# EAGLE design nixie (EAGLE 9.2.2)
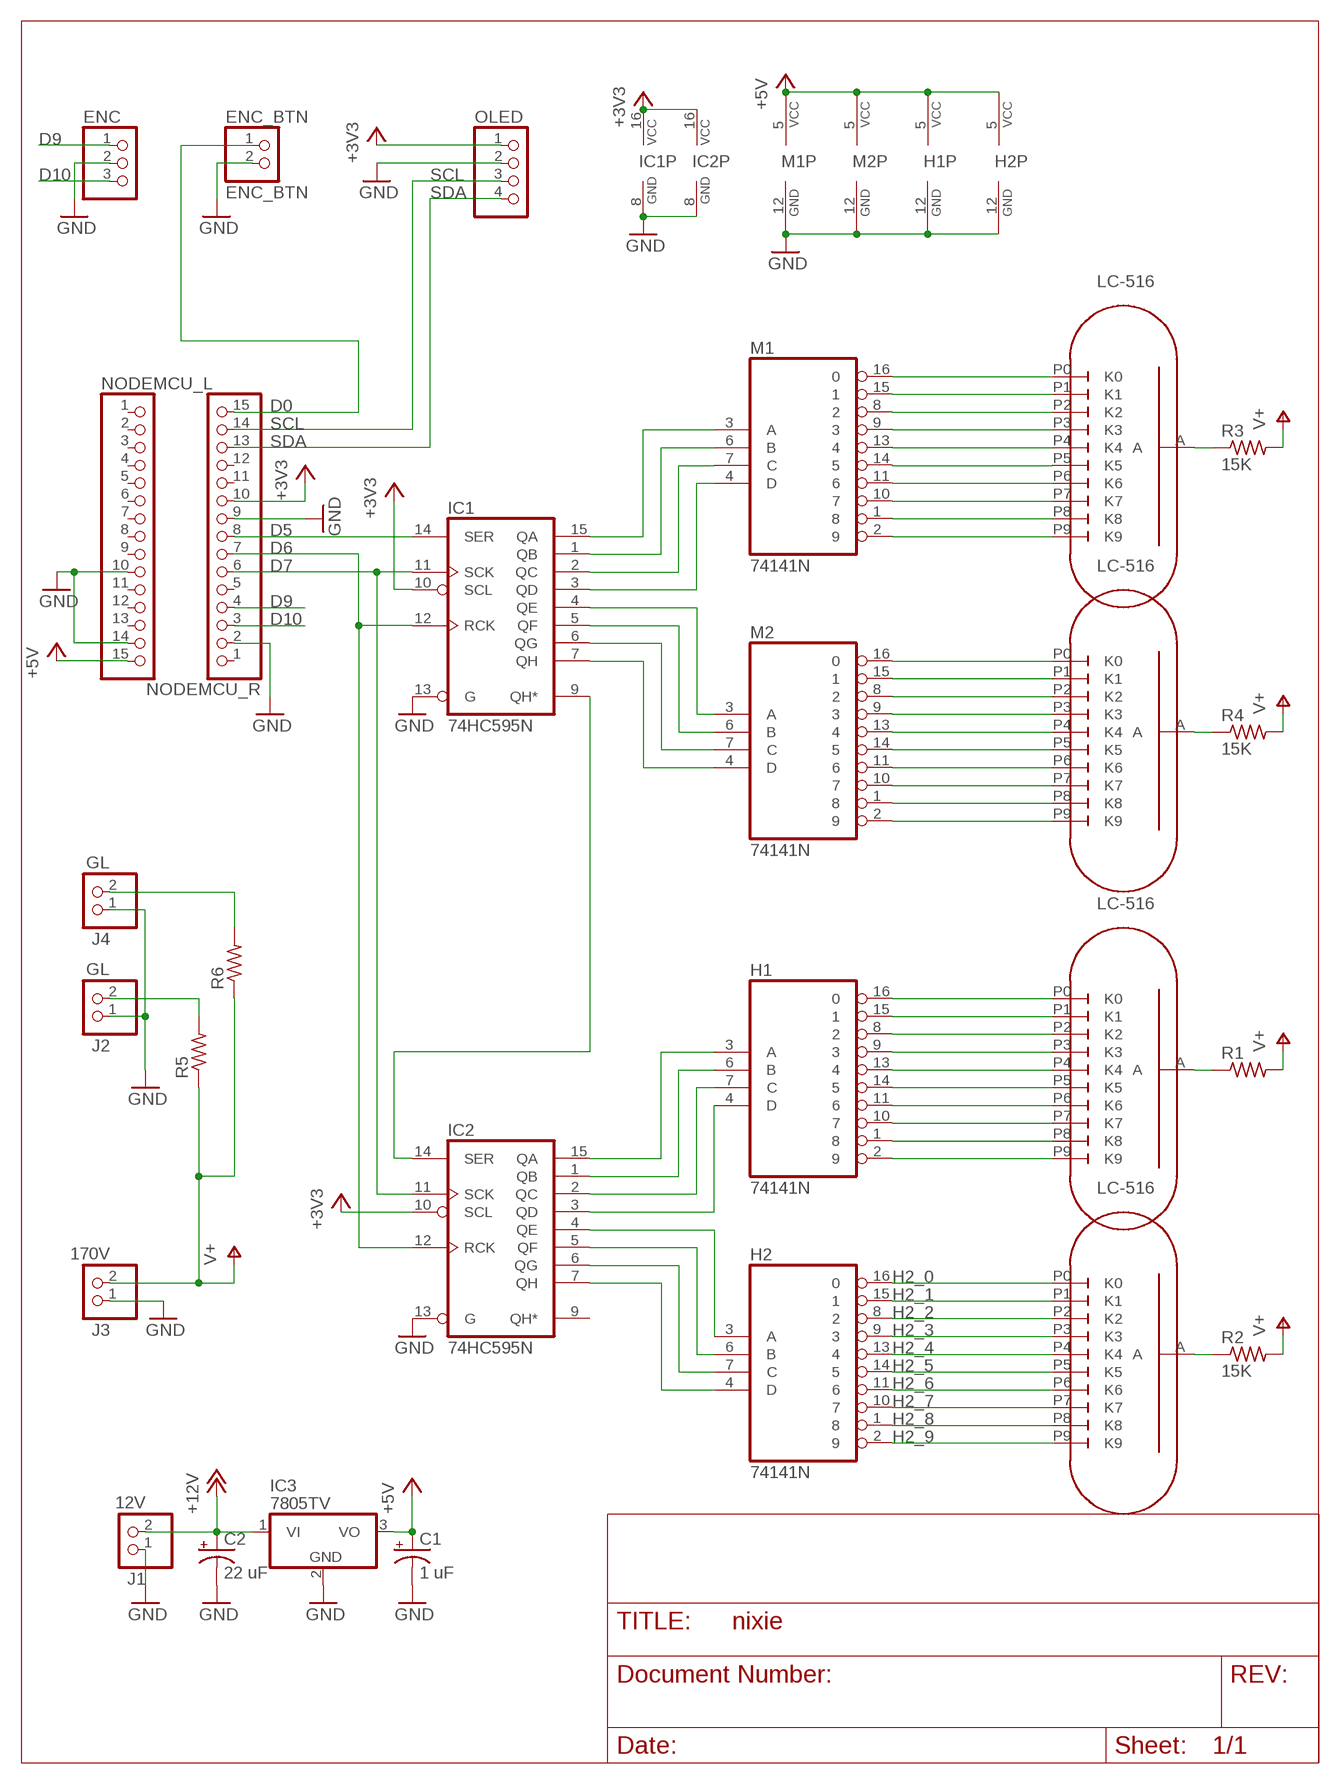
[diagram p0: schematic, sheet 1]

## Parts
C1  1 uF  CPOL-USTT2D5  [TT2D5]
C2  22 uF  CPOL-USTT2D5  [TT2D5]
ENC  PINHD-1X3  [1X03]
ENC_BTN  ENC_BTN  PINHD-1X2  [1X02]
H1  74141N  [DIL16]
H2  74141N  [DIL16]
IC1  74HC595N  [DIL16]
IC2  74HC595N  [DIL16]
IC3  7805TV  [TO220V]
J1  12V  PINHD-1X2  [1X02]
J2  GL  PINHD-1X2  [1X02]
J3  170V  PINHD-1X2  [1X02]
J4  GL  PINHD-1X2  [1X02]
M1  74141N  [DIL16]
M2  74141N  [DIL16]
NODEMCU_L  PINHD-1X15  [1X15]
NODEMCU_R  PINHD-1X15  [1X15]
OLED  PINHD-1X4  [1X04]
R1  15K  R-US_0207/10  [0207/10]
R2  15K  R-US_0207/10  [0207/10]
R3  15K  R-US_0207/10  [0207/10]
R4  15K  R-US_0207/10  [0207/10]
R5  100k  R-US_0207/10  [0207/10]
R6  100k  R-US_0207/10  [0207/10]
U$1M2  LC-516  [LC-516]
U$2M1  LC-516  [LC-516]
U$3H2  LC-516  [LC-516]
U$4H1  LC-516  [LC-516]

## Nets
+3V3: IC1.10(SCL) IC1.16(VCC) IC2.10(SCL) IC2.16(VCC) NODEMCU_R.10 OLED.1
+5V: C1.+ H1.5(VCC) H2.5(VCC) IC3.3(VO) M1.5(VCC) M2.5(VCC) NODEMCU_L.15
+12V: C2.+ IC3.1(VI) J1.2
D0: ENC_BTN.1 NODEMCU_R.15
D5: IC1.14(SER) NODEMCU_R.8
D6: IC1.12(RCK) IC2.12(RCK) NODEMCU_R.7
D7: IC1.11(SCK) IC2.11(SCK) NODEMCU_R.6
D9: ENC.1 NODEMCU_R.4
D10: ENC.3 NODEMCU_R.3
GND: C1.- C2.- ENC.2 ENC_BTN.2 H1.12(GND) H2.12(GND) IC1.8(GND) IC1.13(G) IC2.8(GND) IC2.13(G) IC3.2(GND) J1.1 J2.1 J3.1 J4.1 M1.12(GND) M2.12(GND) NODEMCU_L.10 NODEMCU_L.14 NODEMCU_R.2 NODEMCU_R.9 OLED.2
H2_0: H2.16 U$4H1.P0(K0)
H2_1: H2.15 U$4H1.P1(K1)
H2_2: H2.8 U$4H1.P2(K2)
H2_3: H2.9 U$4H1.P3(K3)
H2_4: H2.13 U$4H1.P4(K4)
H2_5: H2.14 U$4H1.P5(K5)
H2_6: H2.11 U$4H1.P6(K6)
H2_7: H2.10 U$4H1.P7(K7)
H2_8: H2.1 U$4H1.P8(K8)
H2_9: H2.2 U$4H1.P9(K9)
N$1: H1.16 U$3H2.P0(K0)
N$2: H1.2 U$3H2.P9(K9)
N$3: H1.9 U$3H2.P3(K3)
N$4: H1.13 U$3H2.P4(K4)
N$5: H1.14 U$3H2.P5(K5)
N$6: H1.11 U$3H2.P6(K6)
N$7: H1.10 U$3H2.P7(K7)
N$8: H1.1 U$3H2.P8(K8)
N$9: H1.8 U$3H2.P2(K2)
N$10: H1.15 U$3H2.P1(K1)
N$11: R1.1 U$3H2.A
N$12: J4.2 R6.2
N$13: J2.2 R5.2
N$22: R2.1 U$4H1.A
N$23: M1.16 U$1M2.P0(K0)
N$24: M1.9 U$1M2.P3(K3)
N$25: M1.13 U$1M2.P4(K4)
N$26: M1.14 U$1M2.P5(K5)
N$27: M1.11 U$1M2.P6(K6)
N$28: M1.10 U$1M2.P7(K7)
N$29: M1.1 U$1M2.P8(K8)
N$30: M1.2 U$1M2.P9(K9)
N$31: M1.8 U$1M2.P2(K2)
N$32: M1.15 U$1M2.P1(K1)
N$33: R3.1 U$1M2.A
N$34: M2.16 U$2M1.P0(K0)
N$35: M2.9 U$2M1.P3(K3)
N$36: M2.13 U$2M1.P4(K4)
N$37: M2.14 U$2M1.P5(K5)
N$38: M2.11 U$2M1.P6(K6)
N$39: M2.10 U$2M1.P7(K7)
N$40: M2.1 U$2M1.P8(K8)
N$41: M2.2 U$2M1.P9(K9)
N$42: M2.8 U$2M1.P2(K2)
N$43: M2.15 U$2M1.P1(K1)
N$44: R4.1 U$2M1.A
N$45: IC1.15(QA) M1.3(A)
N$46: IC1.1(QB) M1.6(B)
N$47: IC1.2(QC) M1.7(C)
N$48: IC1.3(QD) M1.4(D)
N$49: IC1.4(QE) M2.3(A)
N$50: IC1.5(QF) M2.6(B)
N$51: IC1.6(QG) M2.7(C)
N$52: IC1.7(QH) M2.4(D)
N$53: H1.3(A) IC2.15(QA)
N$54: H1.6(B) IC2.1(QB)
N$55: H1.7(C) IC2.2(QC)
N$56: H1.4(D) IC2.3(QD)
N$57: H2.3(A) IC2.4(QE)
N$58: H2.6(B) IC2.5(QF)
N$59: H2.7(C) IC2.6(QG)
N$60: H2.4(D) IC2.7(QH)
N$61: IC1.9(QH*) IC2.14(SER)
SCL: NODEMCU_R.14 OLED.3
SDA: NODEMCU_R.13 OLED.4
V+: J3.2 R1.2 R2.2 R3.2 R4.2 R5.1 R6.1
Unconnected: IC2.9(QH*) NODEMCU_L.1 NODEMCU_L.2 NODEMCU_L.3 NODEMCU_L.4 NODEMCU_L.5 NODEMCU_L.6 NODEMCU_L.7 NODEMCU_L.8 NODEMCU_L.9 NODEMCU_L.11 NODEMCU_L.12 NODEMCU_L.13 NODEMCU_R.1 NODEMCU_R.5 NODEMCU_R.11 NODEMCU_R.12

## Library data of the parts
C1 C2 = rcl:CPOL-US: POLARIZED CAPACITOR, American symbol; SPICEPREFIX: C
ENC = pinhead:PINHD-1X3: PIN HEADER
ENC_BTN J1-J4 = pinhead:PINHD-1X2: PIN HEADER
H1 H2 M1 M2 = 74xx-us:74*141: BCD to decimal DECODER/DRIVER
IC1 IC2 = 74xx-eu:74*595: 8-bit SHIFT REGISTER, output latch
IC3 = linear:78*: Positive VOLTAGE REGULATOR Source: http://cache.national.com/ds/LM/LM78L05.pdf http://www.fairchildsemi.com/ds/LM/LM7805.pdf
NODEMCU_L NODEMCU_R = pinhead:PINHD-1X15: PIN HEADER
OLED = pinhead:PINHD-1X4: PIN HEADER
R1-R6 = resistor:R-US_: RESISTOR, American symbol
U$1M2 U$2M1 U$3H2 U$4H1 = LC-516:LC-516: Nixie Tube LC-516

## Board
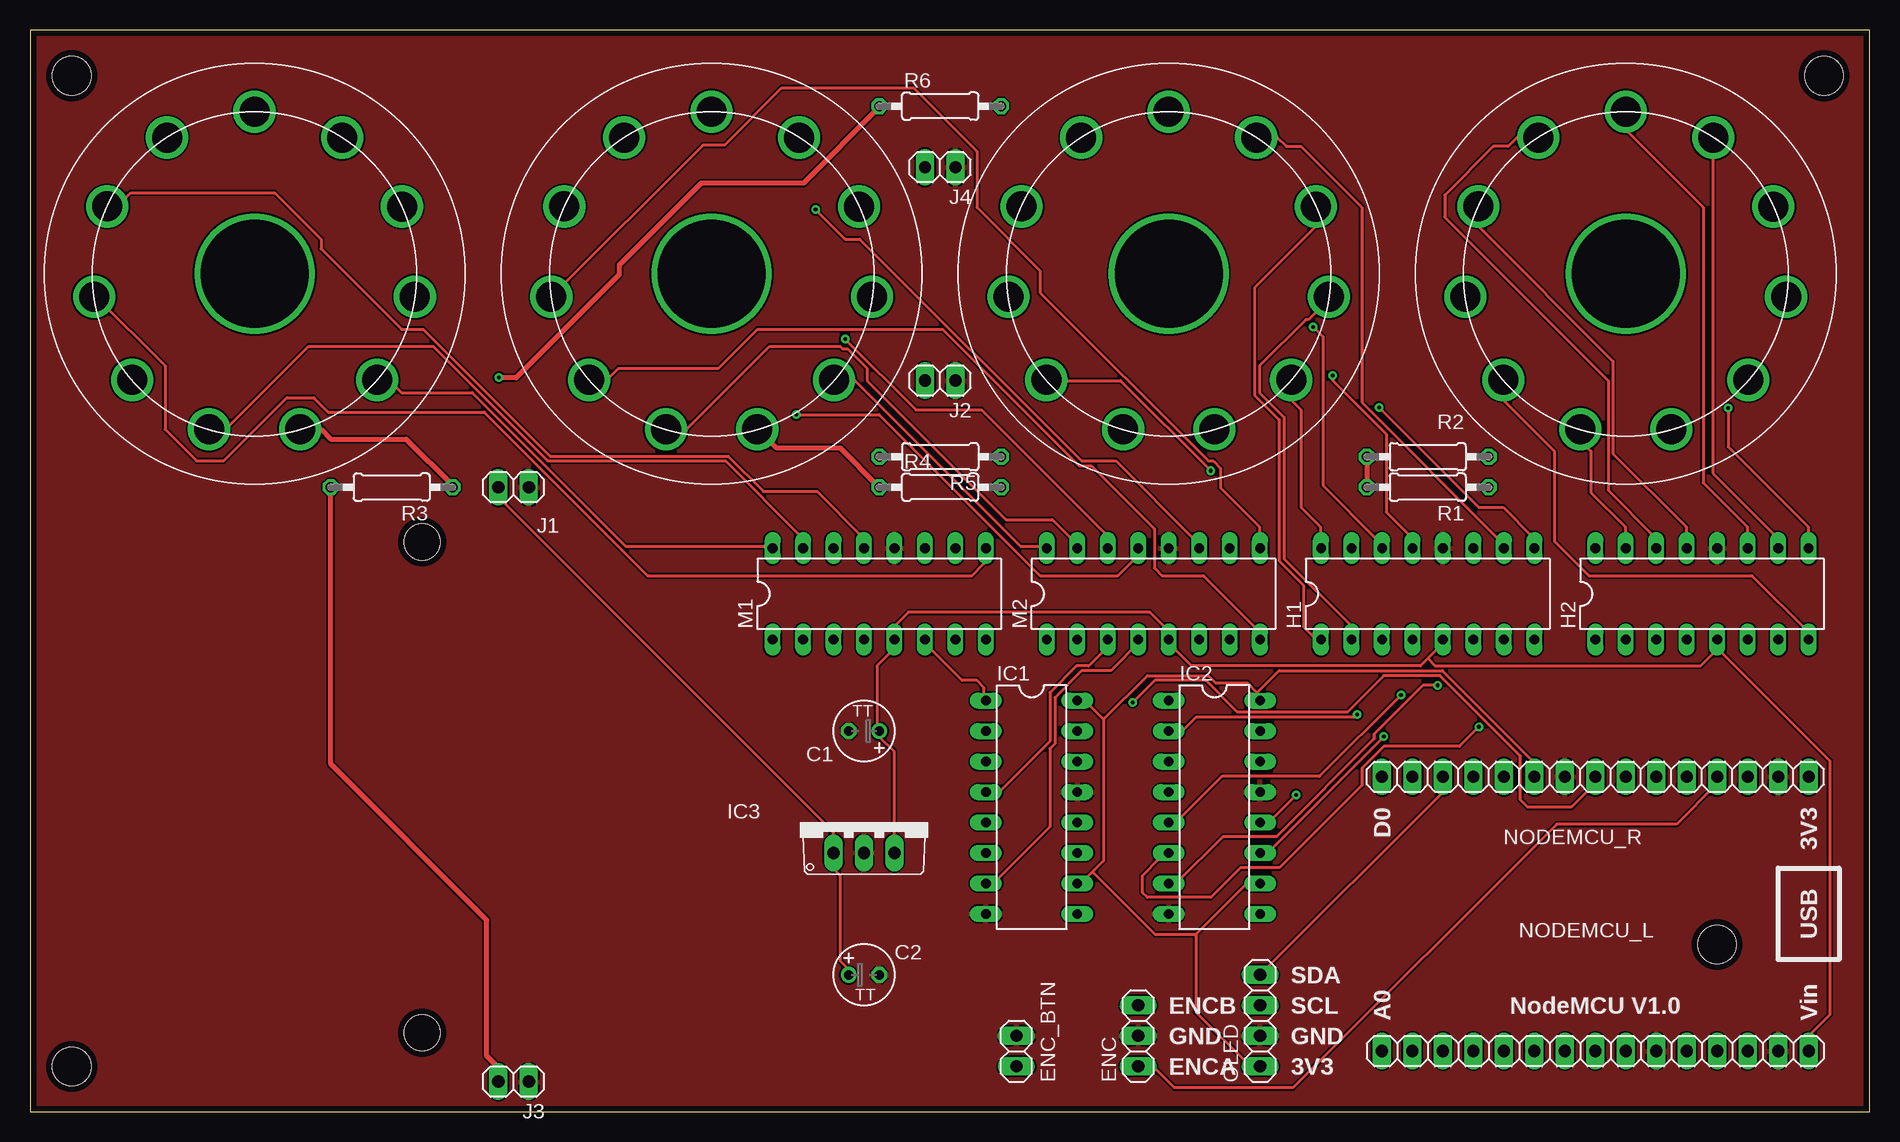
[diagram p1: board, top side]
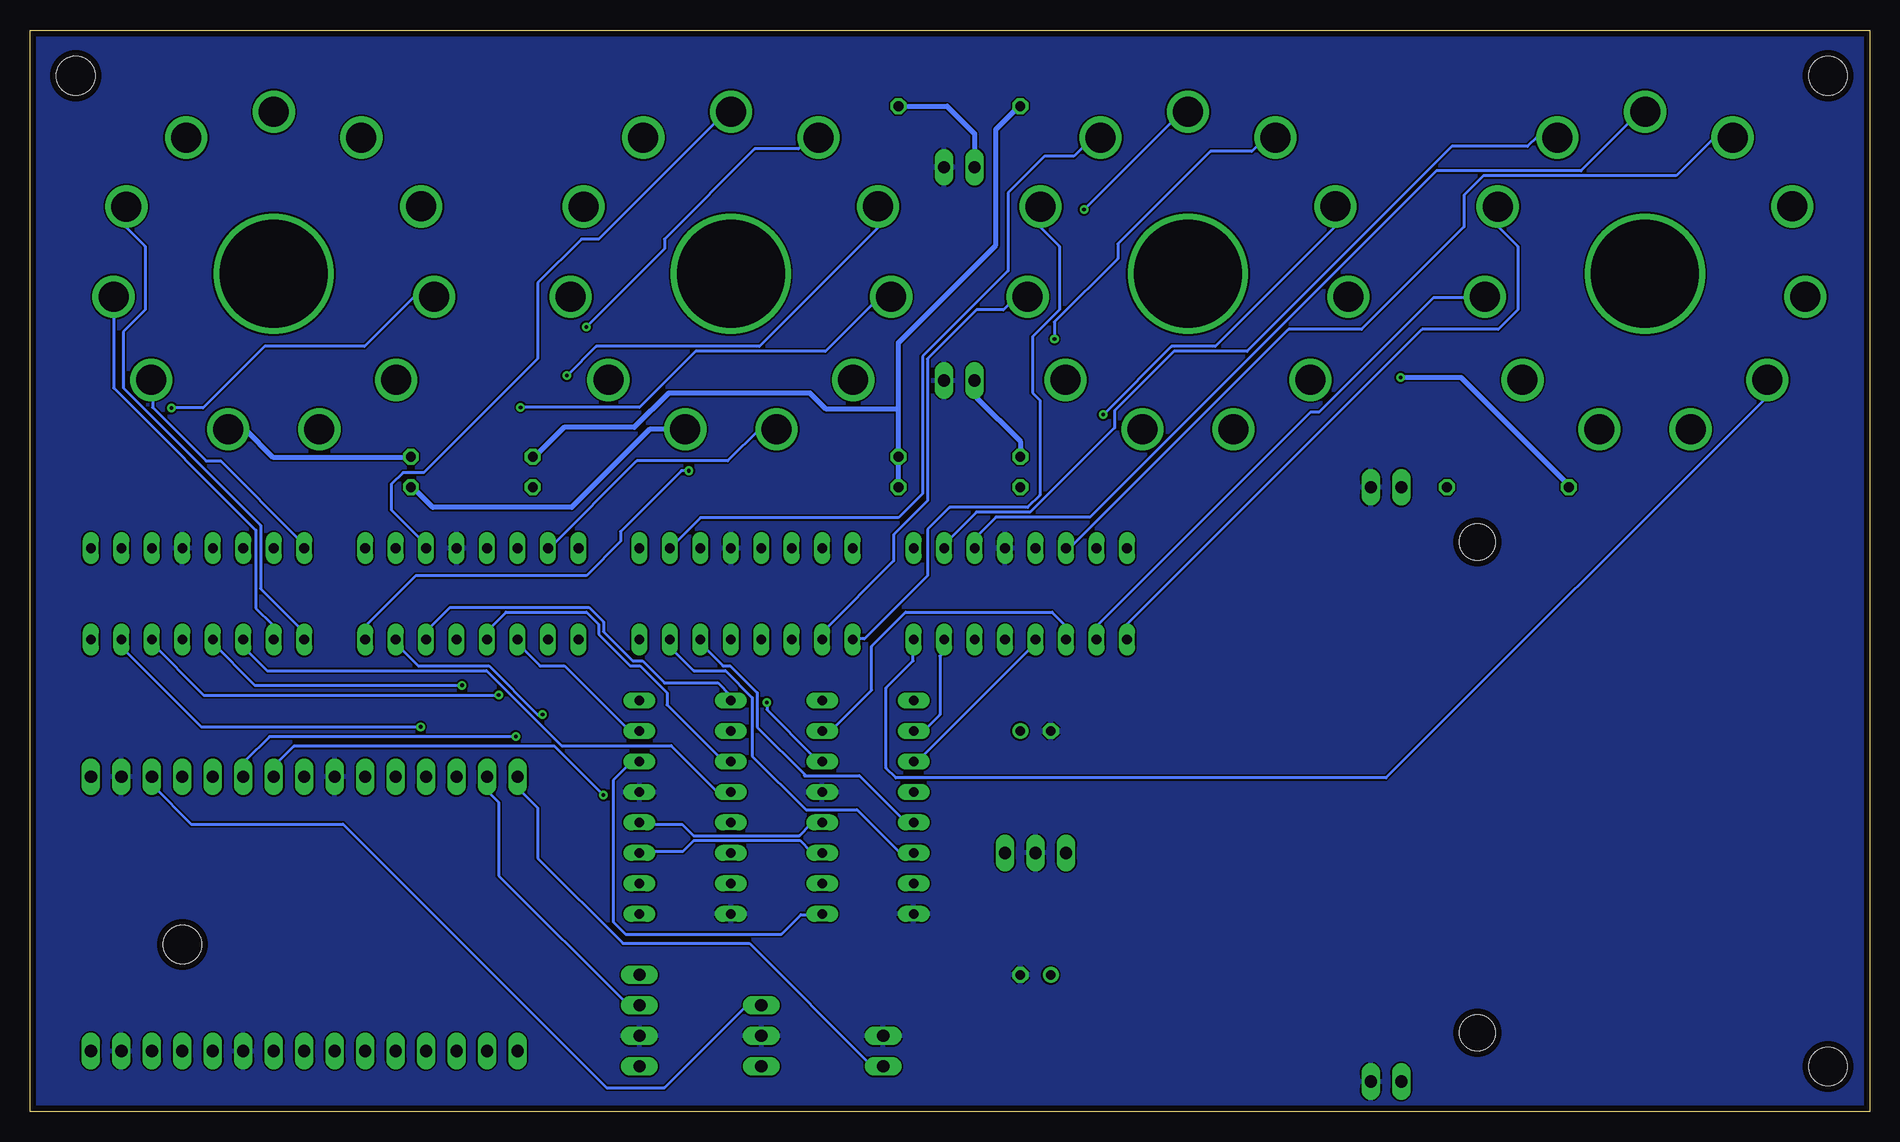
[diagram p2: board, bottom side, seen from below]

Size 153.34 x 90.16 mm. Coordinates in mm from the lower left corner, seen from the top.
Outline: 153.34,90.16 0,90.16 0,0 153.34,0 153.34,90.16
Copper layers (1*16): Top 0.035mm / dielectric 1.5mm / Bottom 0.035mm
Design rules "NYAKARUHAZ_StandardNYAK *": minimum track width 10mil, minimum drill 12mil, track to track 6mil, track to pad 6mil, pad to pad 6mil, via to via 6mil, smd to smd 6mil, copper to edge 20mil, drill to drill 8mil, minimum pad ring 10mil, minimum via ring 8mil, stop-mask expansion 4mil, vias tented up to drill 0mil, thermal gap 6mil
Holes 3.2 mm at 149.53,86.35 3.48,86.35 140.64,13.96 3.48,3.8
Holes 3 mm at 32.69,47.49 32.69,6.59

### Footprints (pad centres in the part's own frame; a part is rotated, then mirrored left to right if it is on the bottom)
TT2D5 = drill 0.813: + -1.27,0 | drill 0.813 octagon: - 1.27,0
1X03 = drill 1.016 long: 1 -2.54,0; 2 0,0; 3 2.54,0
1X02 = drill 1.016 long: 1 -1.27,0; 2 1.27,0
DIL16 = drill 0.813 long: 1 -8.89,-3.81; 2 -6.35,-3.81; 3 -3.81,-3.81; 4 -1.27,-3.81; 5 1.27,-3.81; 6 3.81,-3.81; 7 6.35,-3.81; 8 8.89,-3.81; 9 8.89,3.81; 10 6.35,3.81; 11 3.81,3.81; 12 1.27,3.81; 13 -1.27,3.81; 14 -3.81,3.81; 15 -6.35,3.81; 16 -8.89,3.81
TO220V = drill 1.016 long: 1 -2.54,-2.54; 2 0,-2.54; 3 2.54,-2.54
1X15 = drill 1.016 long: 1 -17.78,0; 2 -15.24,0; 3 -12.7,0; 4 -10.16,0; 5 -7.62,0; 6 -5.08,0; 7 -2.54,0; 8 0,0; 9 2.54,0; 10 5.08,0; 11 7.62,0; 12 10.16,0; 13 12.7,0; 14 15.24,0; 15 17.78,0
1X04 = drill 1.016 long: 1 -3.81,0; 2 -1.27,0; 3 1.27,0; 4 3.81,0
0207/10 = drill 0.813 octagon: 1 -5.08,0; 2 5.08,0
LC-516 = drill 2.5: A 3.8,-12.95; P0 10.205,-8.84; P1 -3.8,-12.95; P2 -10.205,-8.84; P3 -13.365,-1.915; P4 -12.28,5.615; P5 -7.3,11.36; P6 -0.01,13.5; P7 7.295,11.355; P8 12.28,5.61; P9 13.36,-1.915 | drill 9: P$12 0,0

### Placement (x,y rotation side)
C1  69.52,31.74 180 top
C2  69.52,11.42 0 top
ENC  92.38,6.34 90 top
ENC_BTN  82.22,5.07 90 top
H1  116.51,43.17 0 top
H2  139.37,43.17 0 top
IC1  83.49,25.39 270 top
IC2  98.73,25.39 270 top
IC3  69.52,24.12 0 top
J1  40.31,52.06 180 top
J2  75.87,60.95 180 top
J3  40.31,2.53 180 top
J4  75.87,78.73 180 top
M1  70.79,43.17 0 top
M2  93.65,43.17 0 top
NODEMCU_L  130.48,5.07 0 top
NODEMCU_R  130.48,27.93 180 top
OLED  102.54,7.61 90 top
R1  116.51,52.06 180 top
R2  116.51,54.6 180 top
R3  30.15,52.06 180 top
R4  75.87,52.06 0 top
R5  75.87,54.6 180 top
R6  75.87,83.81 0 top
U$1M2  18.72,69.84 0 top
U$2M1  56.82,69.84 0 top
U$3H2  94.92,69.84 0 top
U$4H1  133.02,69.84 0 top

### Tracks (layer width: path | path; a pad name or v marks a point on that pad's centre or on a via)
+3V3
  Top 0.254: 88.57,20 89.48,20.92 89.48,32.71 | 88.57,20 88.06,19.5 87.86,19.5 87.45,19.09 IC1.10 | 89.48,32.71 88.06,34.13 87.45,34.13 IC1.16 | 97.21,14.82 101.27,18.89 102.49,18.89 IC2.10 | 97.21,14.82 93.75,14.82 88.57,20 | 102.29,34.94 101.47,35.75 98.83,35.75 98.22,36.36 93.14,36.36 89.48,32.71 | 102.29,34.94 102.49,34.74 102.49,34.33 IC2.16 | 97.21,14.82 97.21,8.32 101.68,3.85 102.49,3.85 OLED.1 | 102.29,34.94 104.11,36.77 117.73,36.77 125.25,29.25 125.25,28.03 NODEMCU_R.10
+5V
  Top 0.254: IC3.3 72.01,21.73 72.01,30.06 70.79,31.28 C1.+ 70.69,31.74 70.59,31.84 70.59,37.18 72.01,38.6 72.01,39.21 M1.5 72.21,39.41 72.21,40.63 73.23,41.65 93.34,41.65 94.77,40.22 94.77,39.41 M2.5 94.97,39.21 95.38,38.8 95.38,38.6 96.8,37.18 115.9,37.18 116.51,37.79 | 116.51,37.79 117.93,39.21 H1.5 | 140.49,38.4 140.49,39.21 H2.5 | 140.49,38.4 140.69,38.6 150.04,29.25 150.04,8.12 148.41,6.49 148.41,5.07 NODEMCU_L.15 | 140.49,38.4 139.27,37.18 117.12,37.18 116.51,37.79
+12V
  Top 0.254: C2.+ 68.15,11.57 68.15,11.98 67.54,12.59 67.54,19.7 67.13,20.11 67.13,21.53 IC3.1 66.98,23.31 39.09,51.2 39.09,52.01 J1.2
D0
  Bottom 0.254: NODEMCU_R.15 112.7,27.02 111.02,25.34 111.02,21.15 103.91,14.04 93.37,14.04 83.19,3.85 82.37,3.85 ENC_BTN.1
D5  (via drill 0.3)
  Top 0.254: v91.92,34.13 93.75,35.96 98.02,35.96 100.66,33.32 109.8,33.32 112.85,36.36 117.53,36.36 124.23,29.66 124.23,26 124.84,25.39 128.5,25.39 130.33,27.22 130.33,27.83 NODEMCU_R.8
  Bottom 0.254: v91.92,34.13 91.92,33.52 88.06,29.66 87.86,29.66 87.45,29.25 IC1.14
D6  (via drill 0.3)
  Top 0.254: v105.54,26.41 103.3,24.17 102.69,24.17 IC2.12
  Bottom 0.254: IC1.12 87.45,23.97 88.27,23.97 89.2,23.03 98.04,23.03 98.98,23.97 102.49,23.97 IC2.12 | v105.54,26.41 109.6,30.47 131.34,30.47 132.97,28.84 132.97,28.03 NODEMCU_R.7
D7  (via drill 0.3)
  Top 0.254: v112.85,31.28 103.3,21.73 102.69,21.73 IC2.11
  Bottom 0.254: IC1.11 87.45,21.73 88.27,21.73 89.15,22.62 97.99,22.62 98.88,21.73 102.49,21.73 IC2.11 | v112.85,31.28 133.38,31.28 135.41,29.25 135.41,28.03 NODEMCU_R.6
D9
  Top 0.254: ENC.1 92.53,3.65 93.75,3.65 95.38,2.02 105.28,2.02 127.25,23.99 137.26,23.99 140.49,27.22 140.49,27.83 NODEMCU_R.4
D10
  Bottom 0.254: ENC.3 92.53,8.73 93.75,8.73 100.46,2.02 105.28,2.02 127.25,23.99 139.9,23.99 143.13,27.22 143.13,27.83 NODEMCU_R.3
GND
  pour Top: 153.34,90.16 153.34,-0.01 -0.33,-0.01 -0.33,90.16
  pour Bottom: 153.34,90.16 153.34,-0.01 -0.33,-0.01 -0.33,90.16
H2_0
  Bottom 0.254: H2.16 130.53,47.13 130.94,47.54 130.94,47.74 137.44,54.24 138.66,54.24 143.13,58.72 143.13,60.95 U$4H1.P0
H2_1
  Top 0.254: H2.15 132.97,47.13 132.97,48.76 130.12,51.6 130.12,55.06 129.31,55.87 129.31,56.89 U$4H1.P1
H2_2
  Top 0.254: H2.8 148.21,39.41 148.21,40.02 143.54,44.69 129.92,44.69 127.08,47.54 127.08,55.06 122.81,59.32 122.81,60.95 U$4H1.P2
H2_3  (via drill 0.3)
  Top 0.254: v141.55,58.66 141.55,55.41 148.21,48.76 148.21,47.13 H2.9
  Bottom 0.254: v141.55,58.66 138.91,58.66 133.78,63.8 125.45,63.8 121.39,67.86 119.76,67.86 U$4H1.P3
H2_4
  Top 0.254: H2.13 138.05,47.13 138.05,48.76 131.95,54.85 131.95,62.58 120.78,73.75 120.78,75.38 U$4H1.P4
H2_5
  Top 0.254: H2.14 135.41,47.13 135.41,47.95 131.55,51.81 131.55,60.95 117.93,74.56 117.93,76.39 122,80.46 123.22,80.46 124.03,81.27 125.65,81.27 U$4H1.P5
H2_6
  Top 0.254: H2.11 143.13,47.13 143.13,48.76 139.47,52.42 139.47,75.38 133.17,81.68 133.17,83.3 U$4H1.P6
H2_7
  Top 0.254: H2.10 145.57,47.13 145.57,47.95 140.28,53.23 140.28,81.07 U$4H1.P7
H2_8
  Bottom 0.254: H2.1 130.53,39.41 130.53,40.02 134.11,43.6 134.11,48.89 145.57,60.34 145.57,65.01 143.74,66.84 143.74,72.13 145.36,73.75 145.36,75.38 U$4H1.P8
H2_9
  Bottom 0.254: H2.2 133.17,39.41 133.17,40.63 134.52,41.98 134.52,48.48 146.38,60.34 146.38,67.86 U$4H1.P9
N$1
  Top 0.254: H1.16 107.57,47.13 107.57,48.76 105.94,50.38 105.94,58.51 105.13,59.32 105.13,60.95 U$3H2.P0
N$2
  Top 0.254: H1.2 110.01,39.41 110.01,40.63 104.52,46.12 104.52,57.9 102.49,59.93 102.49,62.17 106.35,66.03 106.55,66.03 108.38,67.86 U$3H2.P9
N$3  (via drill 0.3)
  Top 0.254: v112.45,58.72 120.78,50.38 122.81,50.38 125.25,47.95 125.25,47.13 H1.9
  Bottom 0.254: v112.45,58.72 102.54,58.72 97.87,63.39 87.05,63.39 82.58,67.86 81.56,67.86 U$3H2.P3
N$4  (via drill 0.3)
  Top 0.254: v108.59,61.36 108.59,60.95 113.06,56.48 113.06,49.98 115.09,47.95 115.09,47.13 H1.13
  Bottom 0.254: v108.59,61.36 106.15,63.8 92.53,63.8 82.58,73.75 82.58,75.38 U$3H2.P4
N$5  (via drill 0.3)
  Top 0.254: v106.96,65.42 107.77,64.61 107.77,52.21 112.24,47.74 112.24,47.54 112.65,47.13 H1.14
  Bottom 0.254: v106.96,65.42 100.46,71.92 100.46,72.74 92.94,80.25 89.28,80.25 88.47,81.07 87.66,81.07 U$3H2.P5
N$6
  Bottom 0.254: H1.11 120.47,47.44 123.22,50.18 123.22,52.31 122.25,53.28 120.52,53.28 111.02,62.78 111.02,69.08 107.37,72.74 105.94,72.74 95.38,83.3 94.97,83.3 U$3H2.P6
N$7
  Top 0.254: H1.10 122.81,47.13 122.4,47.54 122.4,47.74 111.02,59.12 111.02,75.38 105.94,80.46 104.72,80.46 103.91,81.27 102.29,81.27 U$3H2.P7
N$8
  Top 0.254: H1.1 107.57,39.41 107.16,39.41 106.15,40.43 106.15,43.88 104.11,45.91 104.11,57.7 102.08,59.73 102.08,68.67 107.16,73.75 107.16,75.38 U$3H2.P8
N$9  (via drill 0.3)
  Top 0.254: v98.42,53.43 90.91,60.95 84.81,60.95 U$3H2.P2
  Bottom 0.254: v98.42,53.43 99.03,53.43 104.11,48.35 104.11,47.54 106.96,44.69 121.18,44.69 125.25,40.63 125.25,39.41 H1.8
N$10
  Bottom 0.254: H1.15 110.03,46.98 102.77,54.24 95.17,54.24 92.53,56.89 91.31,56.89 U$3H2.P1
N$11
  Bottom 0.254: 121.39,52.01 121.59,52.01 R1.1
  Bottom 0.406: 121.39,52.01 119.76,50.38 108.18,50.38 101.68,56.89 98.83,56.89 U$3H2.A
N$12
  Bottom 0.406: R6.2 76.89,83.81 74.6,81.52 J4.2
N$13
  Bottom 0.254: 74.45,60.95 J2.2
  Bottom 0.406: R5.2 70.79,55.87 74.45,59.53 74.45,60.95
N$22
  Bottom 0.254: 121.59,54.58 R2.1 | 136.63,56.89 U$4H1.A
  Bottom 0.406: 121.59,54.58 133.1,54.58 135.41,56.89 136.63,56.89
N$23
  Top 0.254: M1.16 61.85,47.13 49.66,47.13 36.86,59.93 30.96,59.93 29.95,60.95 28.93,60.95 U$1M2.P0
N$24
  Top 0.254: M1.9 79.53,46.93 79.53,45.71 78.51,44.69 51.49,44.69 37.87,58.31 24.87,58.31 23.65,59.53 21.41,59.53 16.13,54.24 13.89,54.24 11.25,56.89 11.25,62.17 5.36,68.06 U$1M2.P3
N$25
  Top 0.254: M1.13 69.37,47.13 69.37,47.95 65.61,51.7 61.14,51.7 58.19,54.65 43.36,54.65 32.79,65.22 30.96,65.22 24.26,71.92 24.26,72.74 20.4,76.6 8.41,76.6 7.39,75.58 6.58,75.58 U$1M2.P4
N$26
  Bottom 0.254: M1.14 66.67,46.98 48.44,65.22 42.34,65.22 33.81,73.75 33.81,76.39 32.18,78.02 16.13,78.02 13.08,81.07 11.46,81.07 U$1M2.P5
N$27
  Bottom 0.254: M1.11 74.45,47.13 74.45,47.95 72.82,49.57 64.97,49.57 36.12,78.42 24.05,78.42 19.18,83.3 18.77,83.3 U$1M2.P6
N$28
  Bottom 0.254: M1.10 77.09,47.13 77.06,47.16 77.06,47.36 74.45,49.98 69.98,49.98 62.94,57.01 62.94,58.44 57.99,63.39 51.89,63.39 34.82,80.46 28.52,80.46 27.71,81.27 26.09,81.27 U$1M2.P7
N$29
  Bottom 0.254: M1.1 61.9,40.63 37.31,65.22 30.96,65.22 29.34,66.84 29.34,72.13 30.96,73.75 30.96,75.38 U$1M2.P8
N$30
  Bottom 0.254: M1.2 64.29,39.41 64.29,40.63 46.61,58.31 45.9,58.31 36.35,67.86 32.18,67.86 U$1M2.P9
N$31
  Bottom 0.254: M1.8 79.73,39.21 79.73,37.58 81.97,35.35 81.97,28.64 81.15,27.83 40.31,27.83 8.61,59.53 8.61,60.95 U$1M2.P2
N$32
  Top 0.254: M1.15 64.29,47.13 64.29,47.95 57.99,54.24 43.16,54.24 33.6,63.8 23.24,63.8 16.54,57.09 15.11,57.09 U$1M2.P1
N$33
  Top 0.254: 35.23,52.21 R3.1 | 22.63,56.89 U$1M2.A
  Top 0.406: 35.23,52.21 31.37,56.07 25.07,56.07 24.26,56.89 22.63,56.89
N$34
  Top 0.254: M2.16 84.61,47.13 82.58,47.13 68.76,60.95 67.13,60.95 U$2M1.P0
N$35
  Top 0.254: U$2M1.P3 56.09,80.56 57.89,80.56 62.66,85.33 73.64,85.33 78.92,80.05 78.92,75.38 84.2,70.09 84.2,68.27 98.22,54.24 98.63,54.24 99.24,53.64 99.24,52.01 102.49,48.76 102.49,47.13 M2.9
N$36  (via drill 0.3)
  Top 0.254: v63.88,58.11 70.79,58.11 84.2,44.69 90.7,44.69 92.33,46.32 92.33,46.93 M2.13
  Bottom 0.254: v63.88,58.11 58.19,63.8 54.53,63.8 44.58,73.75 44.58,75.38 U$2M1.P4
N$37  (via drill 0.3)
  Top 0.254: v67.95,64.4 73.84,58.51 79.32,58.51 89.69,48.15 89.69,47.13 M2.14
  Bottom 0.254: v67.95,64.4 67.95,65.83 62.66,71.11 62.66,72.33 54.94,80.05 51.49,80.05 50.47,81.07 49.66,81.07 U$2M1.P5
N$38  (via drill 0.3)
  Top 0.254: v65.48,75.2 67.95,72.74 69.16,72.74 87.66,54.24 90.5,54.24 97,47.74 97,47.54 97.41,47.13 M2.11
  Bottom 0.254: v65.48,75.2 57.38,83.3 56.97,83.3 U$2M1.P6
N$39
  Bottom 0.254: U$2M1.P7 64.29,81.07 64.9,81.07 66.32,79.64 68.76,79.64 71.81,76.6 71.81,70.09 78.94,62.96 78.94,51.53 80.95,49.52 97.46,49.52 M2.10
N$40
  Bottom 0.254: M2.1 84.61,39.41 83.8,39.41 78.51,44.69 78.51,48.55 76.68,50.38 70.18,50.38 69.16,51.4 69.16,59.32 69.77,59.93 69.77,64.61 67.54,66.84 67.54,72.13 69.16,73.75 69.16,75.38 U$2M1.P8
N$41
  Bottom 0.254: M2.2 87.25,39.41 87.25,40.02 81.36,45.91 81.36,48.1 78.54,50.92 78.54,62.75 74.45,66.84 72.21,66.84 71.2,67.86 70.18,67.86 U$2M1.P9
N$42
  Top 0.254: M2.8 102.49,39.41 102.49,40.02 97.82,44.69 94.36,44.69 93.73,45.33 93.73,48.53 93.75,48.55 88.47,53.84 87.45,53.84 76.07,65.22 60.63,65.22 57.38,61.97 49.05,61.97 48.23,61.15 46.81,61.15 U$2M1.P2
N$43
  Top 0.254: M2.15 87.25,47.13 86.84,47.54 86.84,47.74 85.22,49.37 81.36,49.37 69.77,60.95 69.77,61.97 68.15,63.59 67.74,63.59 67.54,63.8 61.65,63.8 54.74,56.89 53.11,56.89 U$2M1.P1
N$44
  Top 0.406: R4.1 67.51,55.34 62.23,55.34 60.62,56.94 U$2M1.A
N$45
  Bottom 0.254: M1.3 67.13,39.41 67.13,40.63 68.15,41.65 80.34,41.65 83.19,38.8 83.19,35.14 86.44,31.89 87.25,31.89 IC1.15
N$46
  Top 0.254: M1.6 74.65,39.21 75.06,38.8 75.06,38.6 77.7,35.96 78.92,35.96 79.53,35.35 79.53,34.33 IC1.1
N$47
  Bottom 0.254: IC1.2 79.53,31.89 78.72,31.89 77.5,33.11 77.5,37.99 77.29,38.19 77.29,39.21 M1.7
N$48
  Bottom 0.254: M1.4 69.57,39.21 69.98,38.8 69.98,38.6 79.53,29.05 IC1.3
N$49
  Top 0.254: IC1.4 79.73,26.81 80.95,26.81 85.01,30.88 85.01,34.94 87.25,37.18 88.27,37.18 89.69,38.6 89.69,39.21 M2.3
N$50
  Bottom 0.254: IC1.5 79.73,24.17 80.34,24.17 84.2,28.03 88.8,28.03 88.75,28.08 92.74,32.07 92.74,34.94 94.97,37.18 95.58,37.18 97.61,39.21 M2.6
N$51
  Bottom 0.254: IC1.6 79.73,21.73 80.95,21.73 84.4,25.19 88.67,25.19 93.14,29.66 93.14,34.53 95.38,36.77 98.02,36.77 99.85,38.6 99.85,39.21 M2.7
N$52
  Top 0.254: IC1.7 79.73,19.09 80.34,19.09 85.01,23.76 85.01,30.27 85.42,30.67 85.42,34.53 87.66,36.77 90.09,36.77 92.53,39.21 M2.4
N$53
  Bottom 0.254: IC2.15 102.69,31.89 103.5,31.89 108.79,37.18 110.82,37.18 112.85,39.21 H1.3
N$54
  Bottom 0.254: IC2.1 94.97,34.33 94.97,34.74 95.99,35.75 100.46,35.75 102.29,37.58 103.1,37.58 105.54,40.02 105.54,40.83 106.76,42.05 118.34,42.05 120.17,40.22 120.17,39.41 H1.6
N$55  (via drill 0.3)
  Top 0.254: v110.62,33.11 110.41,32.91 97.21,32.91 96.19,31.89 94.97,31.89 IC2.2
  Bottom 0.254: v110.62,33.11 111.02,33.11 115.09,37.18 120.98,37.18 123.01,39.21 H1.7
N$56
  Bottom 0.254: IC2.3 94.97,29.25 95.58,29.25 100.25,33.92 100.25,34.94 102.49,37.18 103.3,37.18 105.94,39.82 105.94,40.63 106.96,41.65 113.67,41.65 115.09,40.22 115.09,39.41 H1.4
N$57
  Bottom 0.254: IC2.4 94.97,26.81 96.19,26.81 99.9,30.52 109.04,30.52 115.29,36.77 133.58,36.77 135.41,38.6 135.41,39.21 H2.3
N$58  (via drill 0.3)
  Top 0.254: v114.28,34.74 107.49,27.95 99.36,27.95 95.58,24.17 94.97,24.17 IC2.5
  Bottom 0.254: v114.28,34.74 138.86,34.74 143.33,39.21 H2.6
N$59  (via drill 0.3)
  Top 0.254: v120.78,32.1 119.15,30.47 112.85,30.47 111.02,28.64 111.02,27.22 104.17,20.36 100.91,20.36 98.42,17.87 93.14,17.87 92.74,18.28 92.74,19.7 94.16,21.12 94.36,21.12 94.77,21.53 IC2.6
  Bottom 0.254: v120.78,32.1 139.06,32.1 145.57,38.6 145.57,39.21 H2.7
N$60  (via drill 0.3)
  Top 0.254: v117.32,35.55 116.1,35.55 112.04,31.49 112.04,31.08 103.91,22.95 99.44,22.95 95.58,19.09 94.97,19.09 IC2.7
  Bottom 0.254: v117.32,35.55 134.59,35.55 138.25,39.21 H2.4
N$61
  Bottom 0.254: IC1.9 87.45,16.45 89.08,16.45 90.7,14.82 103.71,14.82 104.72,15.84 104.72,27.62 103.3,29.05 102.69,29.05 IC2.14
SCL
  Bottom 0.254: OLED.3 102.69,8.93 103.5,8.93 114.28,19.7 114.28,25.8 115.09,26.61 115.09,27.83 NODEMCU_R.14
SDA
  Top 0.254: OLED.4 117.73,26.61 117.73,27.83 NODEMCU_R.13
V+  (via drill 0.3)
  Top 0.254: 38.89,2.63 J3.2 | 111.43,52.21 R1.2 | 70.79,83.71 R6.1
  Top 0.406: R3.2 25.07,29 38.08,15.99 38.08,4.66 38.89,3.85 38.89,2.63 | R2.2 111.43,52.21 | v39.09,61.2 39.12,61.18 40.54,61.18 49.12,69.76 49.12,70.58 55.96,77.41 64.49,77.41 70.79,83.71
  Bottom 0.254: 70.99,83.71 70.79,83.71 R6.1 | 111.23,54.65 111.43,54.65 R2.2
  Bottom 0.406: 70.99,83.71 72.82,81.88 72.82,72.23 80.95,64.1 80.95,58.56 | 111.23,54.65 108.84,57.04 102.97,57.04 100.1,59.91 88.32,59.91 86.97,58.56 80.95,58.56 | v39.09,61.2 34.06,61.2 25.07,52.21 R3.2 | R4.2 R5.1 80.95,58.56

### Text on the board
tPlace: D0 | 3V3 | USB | SDA | ENCB | SCL | NodeMCU V1.0 | A0 | Vin | GND | GND | ENCA | 3V3